# EAGLE design CAN_Board - Rev A2 (EAGLE 7.7.0)
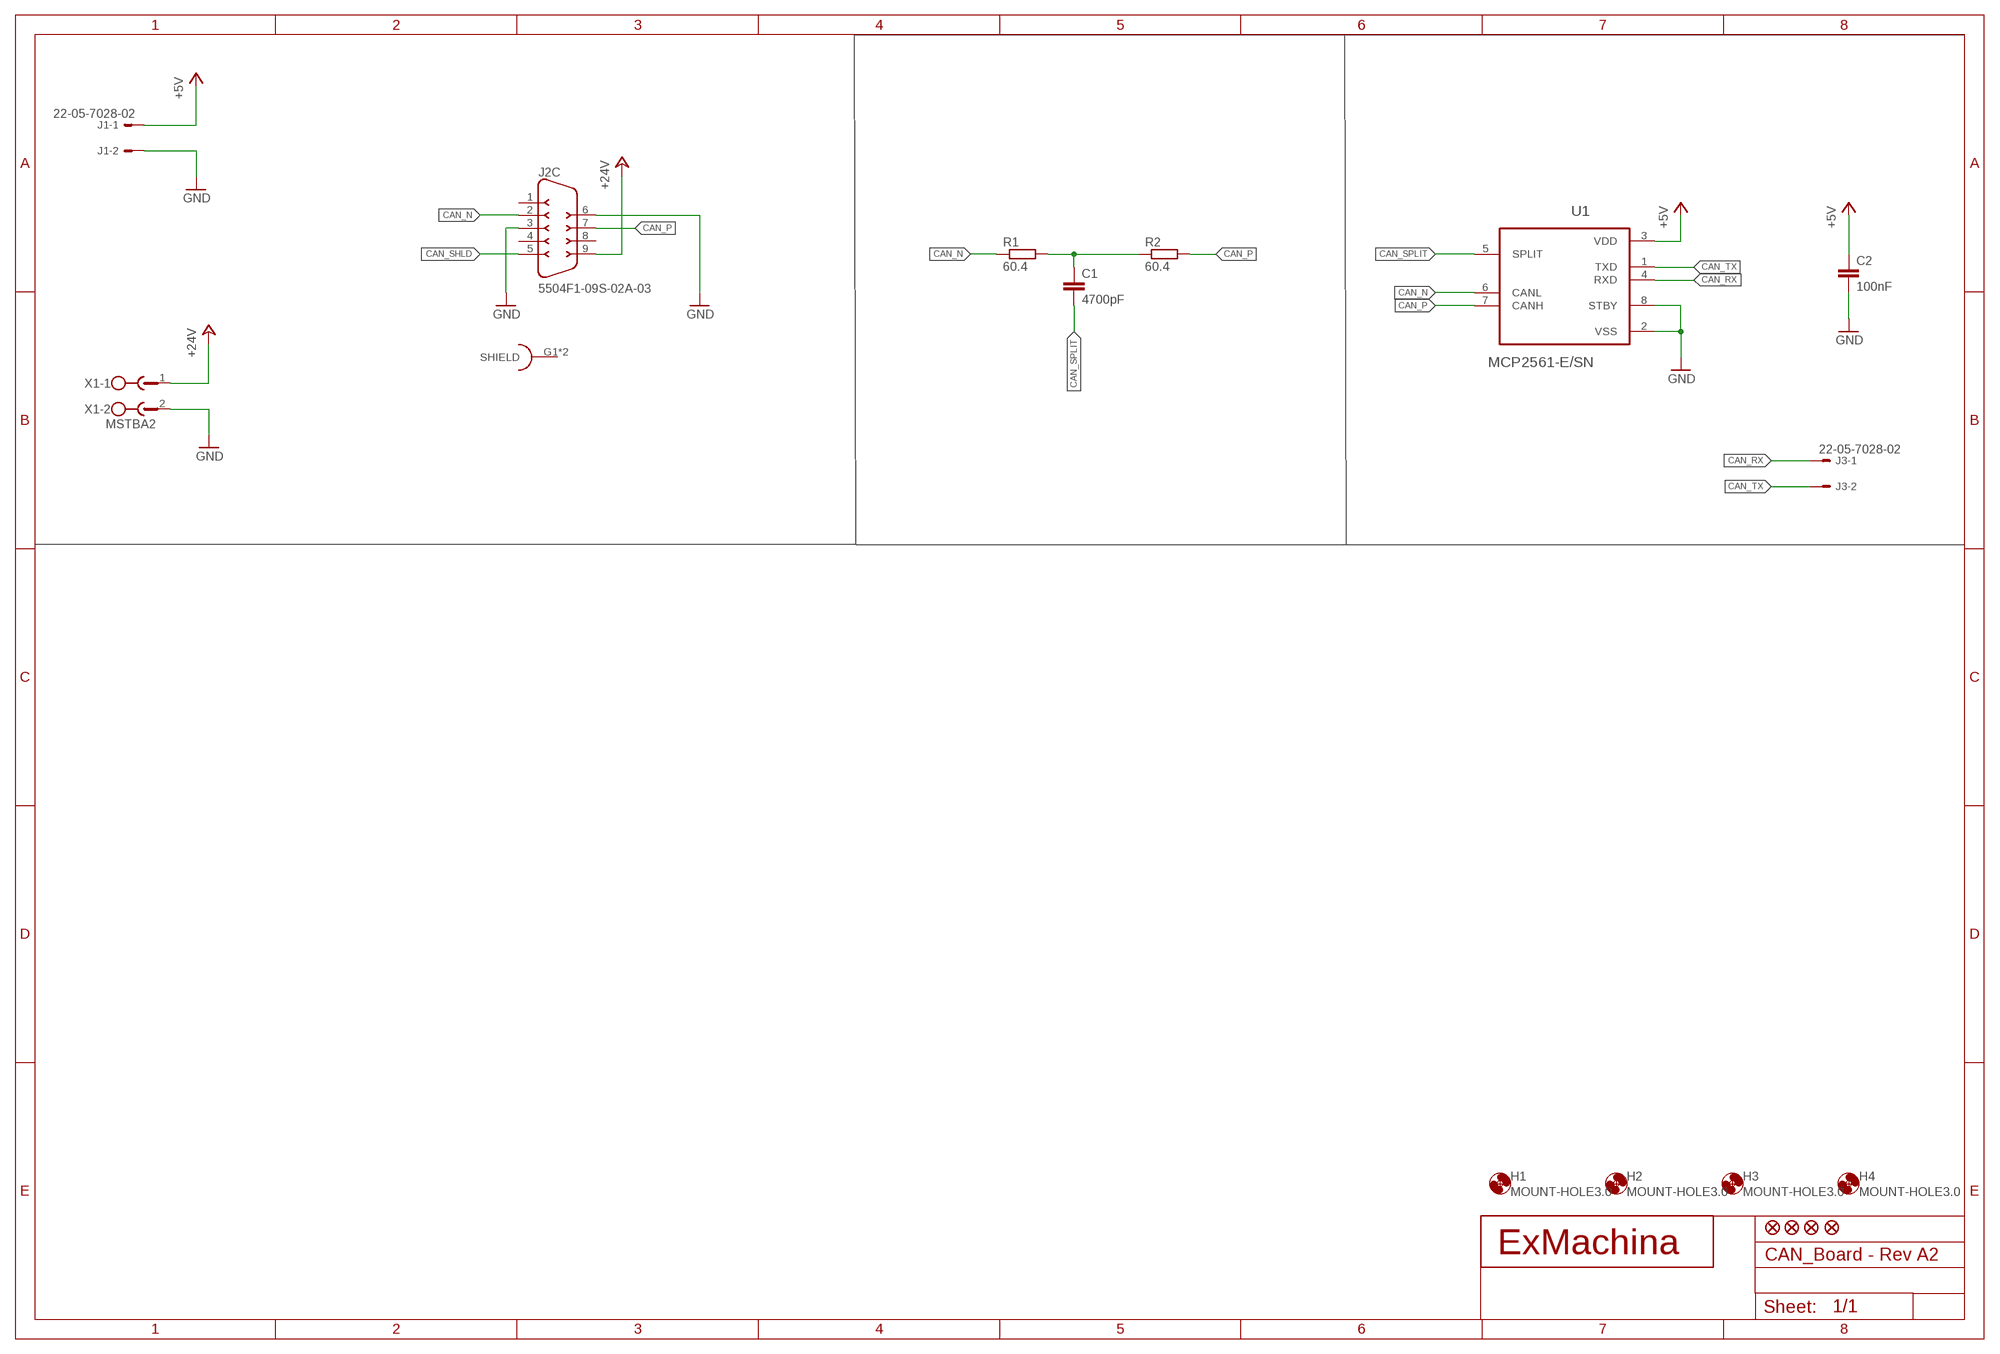
[diagram p0: schematic, sheet 1]

## Parts
C1  4700pF  C-EUC0603  [C0603]
C2  100nF  C-EUC0603  [C0603]
H1  MOUNT-HOLE3.0  [3,0]
H2  MOUNT-HOLE3.0  [3,0]
H3  MOUNT-HOLE3.0  [3,0]
H4  MOUNT-HOLE3.0  [3,0]
J1  22-05-7028-02  [7395-02]
J2  5504F1-09S-02A-03  [5504F1-09S-02A]
J3  22-05-7028-02  [7395-02]
JP1  FIDUCIAL1X2  [FIDUCIAL-1X2]
JP2  FIDUCIAL1X2  [FIDUCIAL-1X2]
JP3  FIDUCIAL1X2  [FIDUCIAL-1X2]
JP4  FIDUCIAL1X2  [FIDUCIAL-1X2]
R1  60.4  R-EU_R0603  [R0603]
R2  60.4  R-EU_R0603  [R0603]
T1  EXMACHINA-LOGO-NAME  [EXM-LOGO-BASELINE]
U1  MCP2561-E/SN  [SOIC127P600X175-8N]
X1  MSTBA2  [MSTBA2]

## Nets
+5V [supply]: C2.1 J1.1 U1.3(VDD)
+24V: J2.9 X1.1
CAN_N [signal]: J2.2 R1.1 U1.6(CANL)
CAN_P [signal]: J2.7 R2.2 U1.7(CANH)
CAN_RX [signal]: J3.1 U1.4(RXD)
CAN_SHLD: J2.5
CAN_SPLIT [signal]: C1.2 U1.5(SPLIT)
CAN_TX [signal]: J3.2 U1.1(TXD)
GND [supply]: C2.2 J1.2 J2.3 J2.6 U1.2(VSS) U1.8(STBY) X1.2
N$3: C1.1 R1.2 R2.1
Unconnected: J2.1 J2.4 J2.8 J2.G1(S:SHIELD) J2.G2(S:SHIELD)

## Library data of the parts
C1 = rcl:C-EU: CAPACITOR, European symbol; MPN: MC0603B472K500CT; OC_NEWARK: 33R0458
C2 = rcl:C-EU: CAPACITOR, European symbol; MPN: MC0603B104K250CT; OC_NEWARK: 06R4925
H1-H4 = holes:MOUNT-HOLE: MOUNTING HOLE with drill center marker; OC_NEWARK: unknown
J1 J3 = con-molex:22-?-02: CONNECTOR wire to board 2.54 mm (.1 inch) pitch header; MPN: 22-05-7028; OC_FARNELL: 9731601; OC_NEWARK: 25M1728
J2 = con-multicomp:5504F1-09S-02A-03: D-Sub 9pts, Righ-angle, solder; MPN: 5504F1-09S-02A-03; OC_NEWARK: 18T0703
JP1-JP4 = SparkFun:FIDUCIAL: Fiducial Alignment Points Various fiducial points for machine vision alignment.; OC_NEWARK: unknown
R1 R2 = rcl:R-EU_: RESISTOR, European symbol; MPN: MCMR06X60R4FTL; OC_NEWARK: 86T3680
T1 = exmachina:EXMACHINA-LOGO; OC_NEWARK: unknown
U1 = Microchip_By_element14_Batch_1:MCP2561-E/SN: High-Speed CAN Transceiver; MPN: MCP2561-E/SN; OC_NEWARK: 12X8698; PACKAGE: SOIC-8; SUPPLIER: Microchip
X1 = con-phoenix-508:MSTBA2: PHOENIX; MF: FARNELL; MPN: 1757242; OC_FARNELL: 3705171; OC_NEWARK: 71C4161

## Net classes
1 signal: width 0.178 mm, drill 0.35 mm
2 supply: width 0.008 mm, drill 0.5 mm

## Board
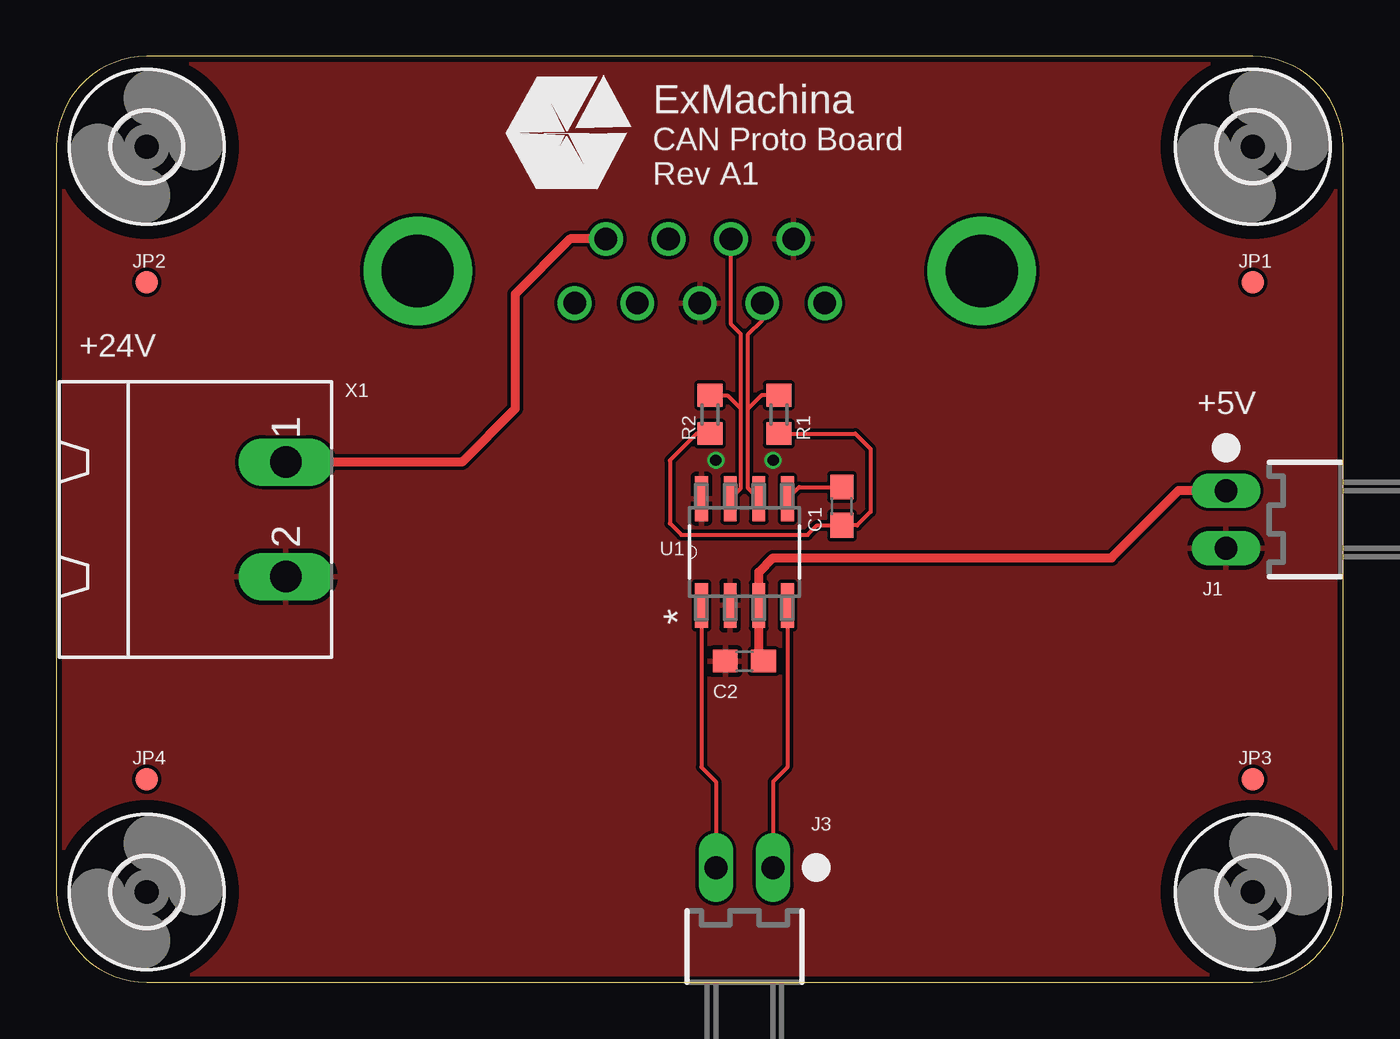
[diagram p1: board, top side]
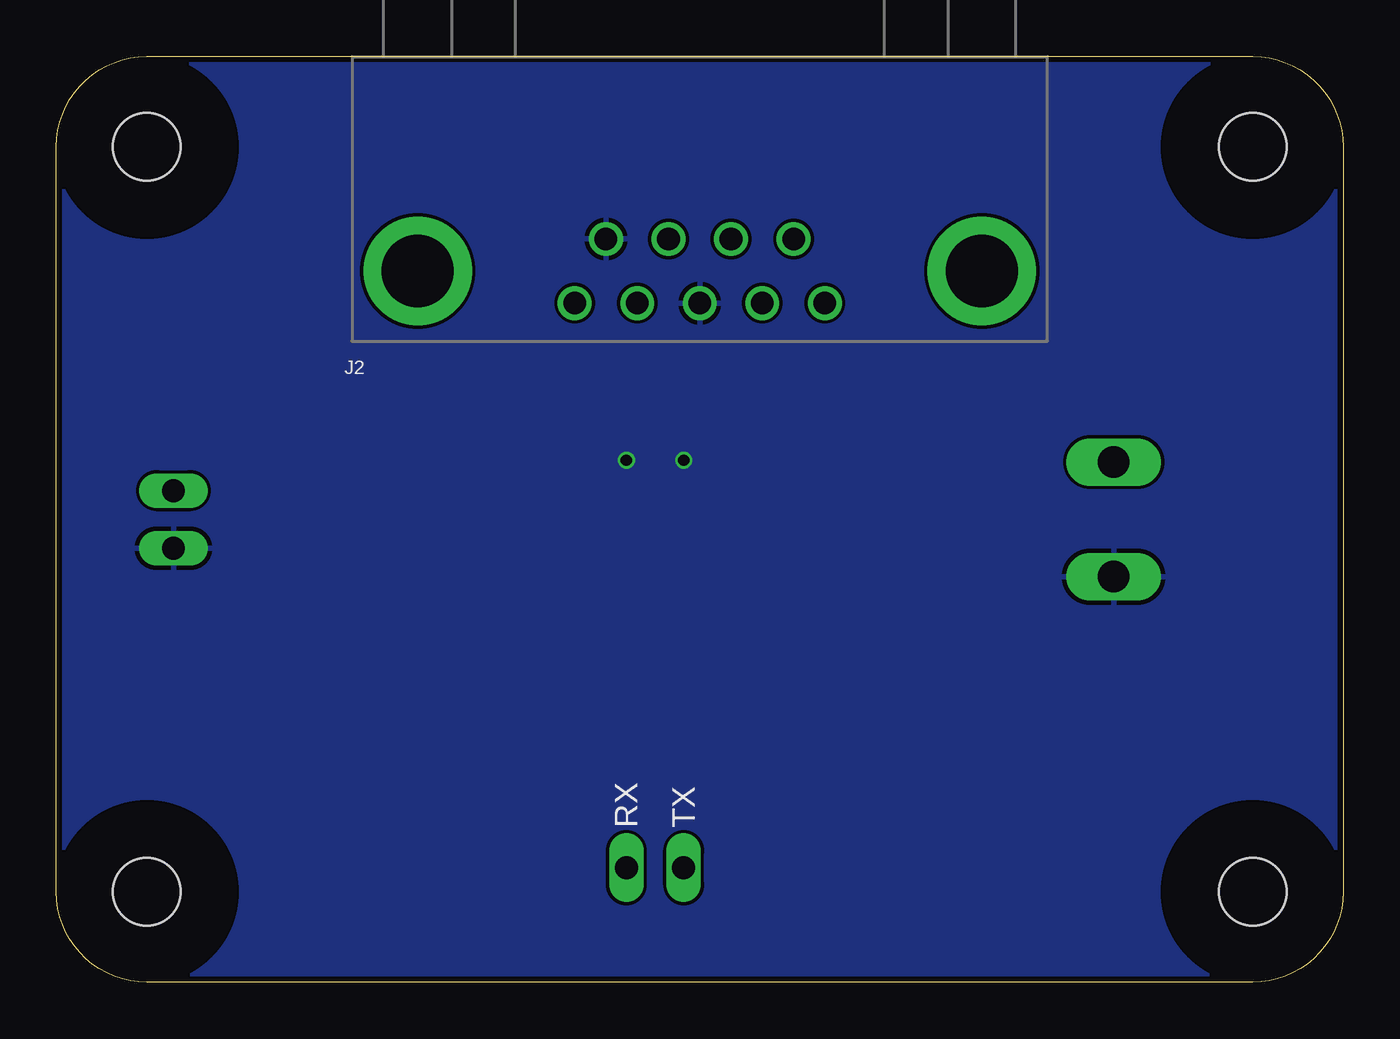
[diagram p2: board, bottom side, seen from below]

Size 57 x 41 mm. Coordinates in mm from the lower left corner, seen from the top.
Outline: 0,37 0,4 arc90 4,0 53,0 arc90 57,4 57,37 arc90 53,41 4,41 arc90 0,37
Copper layers (1*16): Top 0.018mm / dielectric 1.55mm / Bottom 0.018mm
Design rules "eC_2Layer_PClass6_BaseCopperO18_eCDefault *": minimum track width 0.15mm, minimum drill 0.35mm, track to track 0.15mm, track to pad 0.15mm, pad to pad 0.15mm, via to via 0.15mm, smd to smd 0mil, copper to edge 0.25mm, drill to drill 0.35mm, minimum pad ring 0.175mm, minimum via ring 0.125mm, stop-mask expansion 0mil, vias tented up to drill 0.45mm, thermal gap 0.2mm

### Footprints (pad centres in the part's own frame; a part is rotated, then mirrored left to right if it is on the bottom)
C0603 = smd 1.1 x 1: 1 -0.85,0; 2 0.85,0
3,0 = hole 3: 0,0
7395-02 = drill 1.016 long: 1 1.27,0; 2 -1.27,0
5504F1-09S-02A = drill 1: 1 -5.54,-1.42; 2 -2.77,-1.42; 3 0,-1.42; 4 2.77,-1.42; 5 5.54,-1.42; 6 -4.155,1.42; 7 -1.385,1.42; 8 1.385,1.42; 9 4.155,1.42 | drill 3.2: G1 -12.495,0; G2 12.495,0
FIDUCIAL-1X2 = smd 1 x 1: 1 0,0
R0603 = smd 1 x 1.1: 1 -0.85,0; 2 0.85,0
SOIC127P600X175-8N = smd 1.981 x 0.559: 1 -2.362,1.905; 2 -2.362,0.635; 3 -2.362,-0.635; 4 -2.362,-1.905; 5 2.362,-1.905; 6 2.362,-0.635; 7 2.362,0.635; 8 2.362,1.905
MSTBA2 = drill 1.397 long: 1 -2.54,5.08; 2 2.54,5.08

### Placement (x,y rotation side)
C1  34.8,21.08 90 top
C2  30.48,14.22 180 top
H1  53,37 0 top
H2  4,37 0 top
H3  53,4 0 top
H4  4,4 0 top
J1  51.82,20.5 90 top
J2  28.5,31.5 0 bottom
J3  30.48,5.08 0 top
JP1  53,31 0 top
JP2  4,31 0 top
JP3  53,9 0 top
JP4  4,9 0 top
R1  32,25.15 270 top
R2  28.96,25.15 90 top
T1  22.61,37.59 0 top
U1  30.48,19.05 90 top
X1  5.08,20.5 270 top

### Tracks (layer width: path | path; a pad name or v marks a point on that pad's centre or on a via)
+5V
  Top 0.406: C2.1 31.11,14.22 U1.3 31.11,18.16 31.75,18.8 46.74,18.8 49.71,21.77 J1.1
+24V
  Top 0.406: J2.9 22.76,32.92 20.32,30.48 20.32,25.4 17.96,23.04 X1.1
CAN_N
  Top 0.178: U1.6 30.64,21.88 30.64,25.4 | 30.64,25.4 30.64,28.7 31.27,29.33 J2.2 | R1.1 31.24,26 30.64,25.4
CAN_P
  Top 0.178: U1.7 30.32,21.88 30.32,25.4 | 30.32,25.4 30.32,28.7 29.89,29.13 J2.7 | R2.2 29.72,26 30.32,25.4
CAN_RX
  Top 0.178: U1.4 32.38,9.53 31.75,8.89 J3.1
CAN_SPLIT
  Top 0.178: U1.5 32.91,21.93 C1.2
CAN_TX
  Top 0.178: U1.1 28.57,9.53 29.21,8.89 J3.2
GND  (via drill 0.5)
  other vias: 29.21,23.11 31.75,23.11
  pour Top: -5.08,-3.81 -5.08,49.53 63.5,49.53 63.5,-3.81
  pour Bottom: -6.35,-5.08 -6.35,50.8 64.77,50.8 64.77,-5.08
N$3
  Top 0.178: R2.1 28.36,24.3 27.18,23.11 27.18,20.32 27.69,19.81 33.27,19.81 33.69,20.23 C1.1 35.47,20.23 36.07,20.83 36.07,23.62 35.39,24.3 R1.2

### Text on the board
tPlace: CAN Proto Board / Rev A1 | +24V | +5V
bPlace: TX | RX